# Altium schematic sheet STM32.SchDoc: TMC2130
size A; DrawnBy: Luka & Emile
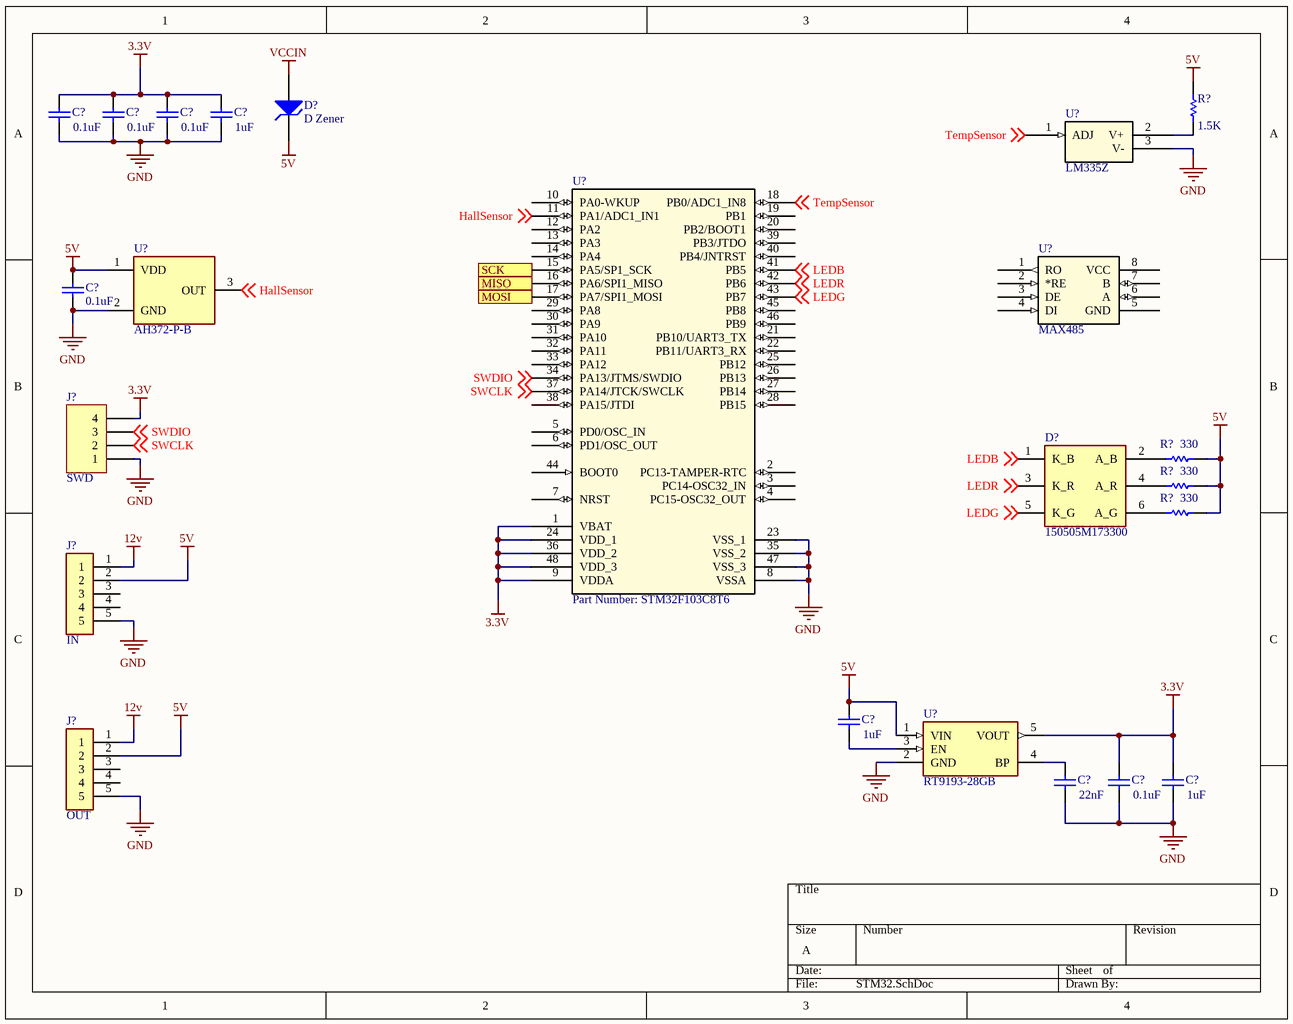
[diagram p0: STM32.SchDoc]

## Parts
(Parts that share a designator on the sheet are numbered #1, #2 ... from top to bottom, then left to right.)
C?#1  value 0.1uF  [RAD-0.3]
C?#2  value 0.1uF  [RAD-0.3]
C?#3  value 0.1uF  [RAD-0.3]
C?#4  value 1uF  [RAD-0.3]
C?#5  value 0.1uF  [RAD-0.3]
C?#6  value 1uF  [RAD-0.3]
C?#7  value 22nF  [RAD-0.3]
C?#8  value 0.1uF  [RAD-0.3]
C?#9  value 1uF  [RAD-0.3]
D?#1  D Zener  [DIODE-0.7]
D?#2  150505M173300  [150505M173300]
J?#1  SWD  [HDR1X4]
J?#2  IN  [S5BXHA1LFSN]
J?#3  OUT  [S5BXHA1LFSN]
R?#1  value 1.5K  [AXIAL-0.3]
R?#2  value 330  [AXIAL-0.3]
R?#3  value 330  [AXIAL-0.3]
R?#4  value 330  [AXIAL-0.3]
U?#1  LM335Z  [TO92]
U?#2  Part Number: STM32F103C8T6  [LQFP-48]
U?#3  MAX485  [21-0043D_8]
U?#4  AH372-P-B  [AH372PB]
U?#5  RT9193-28GB  [SOT94P279X130-5N]

## Ports
MISO, MOSI, SCK

## Nets
3.3V: C?#1.1 C?#2.1 C?#3.1 C?#4.1 C?#8.1 C?#9.1 J?#1.4 U?#2.1(VBAT) U?#2.9(VDDA) U?#2.24(VDD_1) U?#2.36(VDD_2) U?#2.48(VDD_3) U?#5.5(VOUT)
5V: C?#5.2 C?#6.1 D?#1.2(K) J?#2.2 J?#3.2 R?#1.2 R?#2.1 R?#3.1 R?#4.1 U?#4.1(VDD) U?#5.1(VIN)
12v: J?#2.1 J?#3.1
GND: C?#1.2 C?#2.2 C?#3.2 C?#4.2 C?#5.1 C?#7.2 C?#8.2 C?#9.2 J?#1.1 J?#2.5 J?#3.5 U?#1.3(V-) U?#2.8(VSSA) U?#2.23(VSS_1) U?#2.35(VSS_2) U?#2.47(VSS_3) U?#4.2(GND) U?#5.2(GND)
VCCIN: D?#1.1(A)
HallSensor: U?#2.11(PA1/ADC1_IN1) U?#4.3(OUT) ; off-sheet HallSensor
LEDB: D?#2.1(K_B) U?#2.41(PB5) ; off-sheet LEDB
LEDG: D?#2.5(K_G) U?#2.43(PB7) ; off-sheet LEDG
LEDR: D?#2.3(K_R) U?#2.42(PB6) ; off-sheet LEDR
MISO: U?#2.16(PA6/SPI1_MISO) ; port MISO
MOSI: U?#2.17(PA7/SPI1_MOSI) ; port MOSI
SCK: U?#2.15(PA5/SP1_SCK) ; port SCK
SWCLK: J?#1.2 U?#2.37(PA14/JTCK/SWCLK) ; off-sheet SWCLK
SWDIO: J?#1.3 U?#2.34(PA13/JTMS/SWDIO) ; off-sheet SWDIO
TempSensor: U?#1.1(ADJ) U?#2.18(PB0/ADC1_IN8) ; off-sheet TempSensor
NetC?#6_2: C?#6.2 U?#5.3(EN)
NetC?#7_1: C?#7.1 U?#5.4(BP)
NetD?#2_2: D?#2.2(A_B) R?#2.2
NetD?#2_4: D?#2.4(A_R) R?#3.2
NetD?#2_6: D?#2.6(A_G) R?#4.2
NetR?#1_1: R?#1.1 U?#1.2(V+)

Not connected (* = marked no-connect by the designer): J?#2 3 4; J?#3 3 4; U?#2 2(PC13-TAMPER-RTC) 3(PC14-OSC32_IN) 4(PC15-OSC32_OUT) 5(PD0/OSC_IN) 6(PD1/OSC_OUT) 7(NRST) 10(PA0-WKUP) 12(PA2) 13(PA3) 14(PA4) 19(PB1) 20(PB2/BOOT1) 21(PB10/UART3_TX) 22(PB11/UART3_RX) 25(PB12) 26(PB13) 27(PB14) 28(PB15) 29(PA8) 30(PA9) 31(PA10) 32(PA11) 33(PA12) 38(PA15/JTDI) 39(PB3/JTDO) 40(PB4/JNTRST) 44(BOOT0) 45(PB8) 46(PB9); U?#3 1(RO) 2(*RE) 3(DE) 4(DI) 5(GND) 6(A) 7(B) 8(VCC)

## Library data of the parts
C?#1-C?#9 = Cap: Capacitor; Published: 8-Jun-2000; LatestRevisionDate: 17-Jul-2002; LatestRevisionNote: Re-released for DXP Platform.; PackageReference: RAD-0.3; Publisher: Altium Limited; PackageDescription: Radial Cap, Thru-Hole; 2 Leads; 0.3 in Pin Spacing
D?#1 = D Zener: Zener Diode; Published: 8-Jun-2000; LatestRevisionDate: 17-Jul-2002; LatestRevisionNote: Re-released for DXP Platform.; PackageReference: DIODE-0.7; Publisher: Altium Limited; PackageDescription: Diode, Thru-Hole; 2 Leads; 0.7 in Pin Spacing
D?#2 = 150505M173300: LED; Manufacturer_Name: Wurth Elektronik; Datasheet Link: https://katalog.we-online.de/led/datasheet/150505M173300.pdf; Height: 1.8mm; Manufacturer_Part_Number: 150505M173300; Mouser Part Number: 710-150505M173300; Mouser Price/Stock: https://www.mouser.com/Search/Refine.aspx?Keyword=710-150505M173300; RS Part Number: 1766248P; RS Price/Stock: http://uk.rs-online.com/web/p/products/1766248P
J?#1 = Header 4: Header, 4-Pin; LatestRevisionDate: 17-Jul-2002; LatestRevisionNote: Re-released for DXP Platform.; Publisher: Altium Limited
J?#2 J?#3 = JST 5POS: Connector; Manufacturer_Name: JST (JAPAN SOLDERLESS TERMINALS); Manufacturer_Part_Number: S5B-XH-A-1(LF)(SN); Datasheet Link: http://www.jst-mfg.com/product/pdf/eng/eXH.pdf; Height: 6.1mm
R?#1-R?#4 = Res1: Resistor; Published: 8-Jun-2000; LatestRevisionDate: 17-Jul-2002; LatestRevisionNote: Re-released for DXP Platform.; PackageReference: AXIAL-0.3; Publisher: Altium Limited; PackageDescription: Axial Device, Thru-Hole; 2 Leads; 0.3 in Pin Spacing
U?#1 = LM335Z: Temperature Sensor; VENDOR: STMicroelectronics; Built_By: EMA_UL_Team; MANUFACTURER_PART_NUMBER: LM335Z; Copyright: Copyright (C) 2018 Accelerated Designs. All rights reserved; RefDes: RefDes; Type: DEV; Value: Value
U?#2 = STM32F103C8T6: Integrated Circuit STM32; Vendor: STMicroelectronics; Built_By: EMA_UL_Team; Manufacturer_Part_Number: STM32F103C8T6; Copyright: Copyright (C) 2018 Accelerated Designs. All rights reserved; RefDes: RefDes; Type: DEV; Value: Value
U?#3 = MAX485CPA+: RS485 Communication; Vendor: Maxim Integrated Products; Built_By: EMA_UL_Team; Manufacturer_Part_Number: MAX485CPA+; Copyright: Copyright (C) 2018 Accelerated Designs. All rights reserved; RefDes: RefDes; Type: DEV; Value: Value
U?#4 = AH372-P-B: Hall Sensor; Manufacturer_Name: Diodes Inc.; Datasheet Link: https://www.mouser.com/datasheet/2/115/AH372-1317530.pdf; Height: 4.75mm; Manufacturer_Part_Number: AH372-P-B; Mouser Part Number: 621-AH372-P-B; Mouser Price/Stock: https://www.mouser.com/Search/Refine.aspx?Keyword=621-AH372-P-B; RS Part Number: 1333361P; RS Price/Stock: http://uk.rs-online.com/web/p/products/1333361P
U?#5 = RT9193-28GB: Voltage Regulator 3.3V; Manufacturer_Name: RICHTEK; Datasheet Link: https://componentsearchengine.com/Datasheets/2/RT9193-28GB.pdf; Height: 1.295mm; Manufacturer_Part_Number: RT9193-28GB